# EAGLE design ne555_ht (EAGLE 7.6.0)
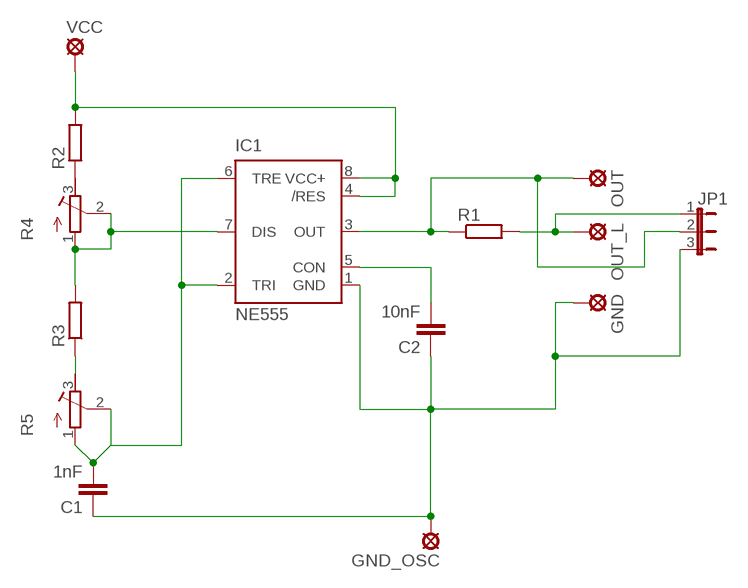
[diagram p0: schematic, sheet 1]

## Parts
C1  1nF  C-EU050-024X044  [C050-024X044]
C2  10nF  C-EU050-024X044  [C050-024X044]
GND  LSP13  [LSP13]
GND_OSC  LSP13  [LSP13]
IC1  NE555  [DIL-08]
JP1  JP2E  [JP2]
OUT  LSP13  [LSP13]
OUT_L  LSP13  [LSP13]
R1  R-EU_0207/10  [0207/10]
R2  R-EU_0207/12  [0207/12]
R3  R-EU_0207/12  [0207/12]
R4  R-TRIMM3339P  [RTRIM3339P]
R5  R-TRIMM3339P  [RTRIM3339P]
VCC  LSP13  [LSP13]

## Nets
N$1: R2.1 R4.3(E)
N$2: IC1.4(/RES) IC1.8(VCC+) R2.2 VCC.MP
N$3: C2.2 IC1.5(CON)
N$5: C1.1 C2.1 GND.MP GND_OSC.MP IC1.1(GND) JP1.3
N$8: IC1.3(OUT) JP1.2 OUT.MP R1.1
N$9: JP1.1 OUT_L.MP R1.2
N$11: IC1.7(DIS) R3.2 R4.1(A) R4.2(S)
N$12: R3.1 R5.3(E)
N$13: C1.2 IC1.2(TRI) IC1.6(TRE) R5.1(A) R5.2(S)

## Library data of the parts
C1 C2 = rcl:C-EU: CAPACITOR, European symbol
GND GND_OSC OUT OUT_L VCC = solpad:LSP13: SOLDER PAD drill 1.3 mm, distributor Buerklin, 12H562
IC1 = st-microelectronics:NE555: General purpose bipolar Timer; MF: Arrow Electronics; MPN: NE555N; OC_FARNELL: 1467742; OC_NEWARK: 89K1486
JP1 = jumper:JP2E: JUMPER
R1 = resistor:R-EU_: RESISTOR, European symbol
R2 R3 = rcl:R-EU_: RESISTOR, European symbol
R4 R5 = rcl:R-TRIMM: Trimm resistor

## Board
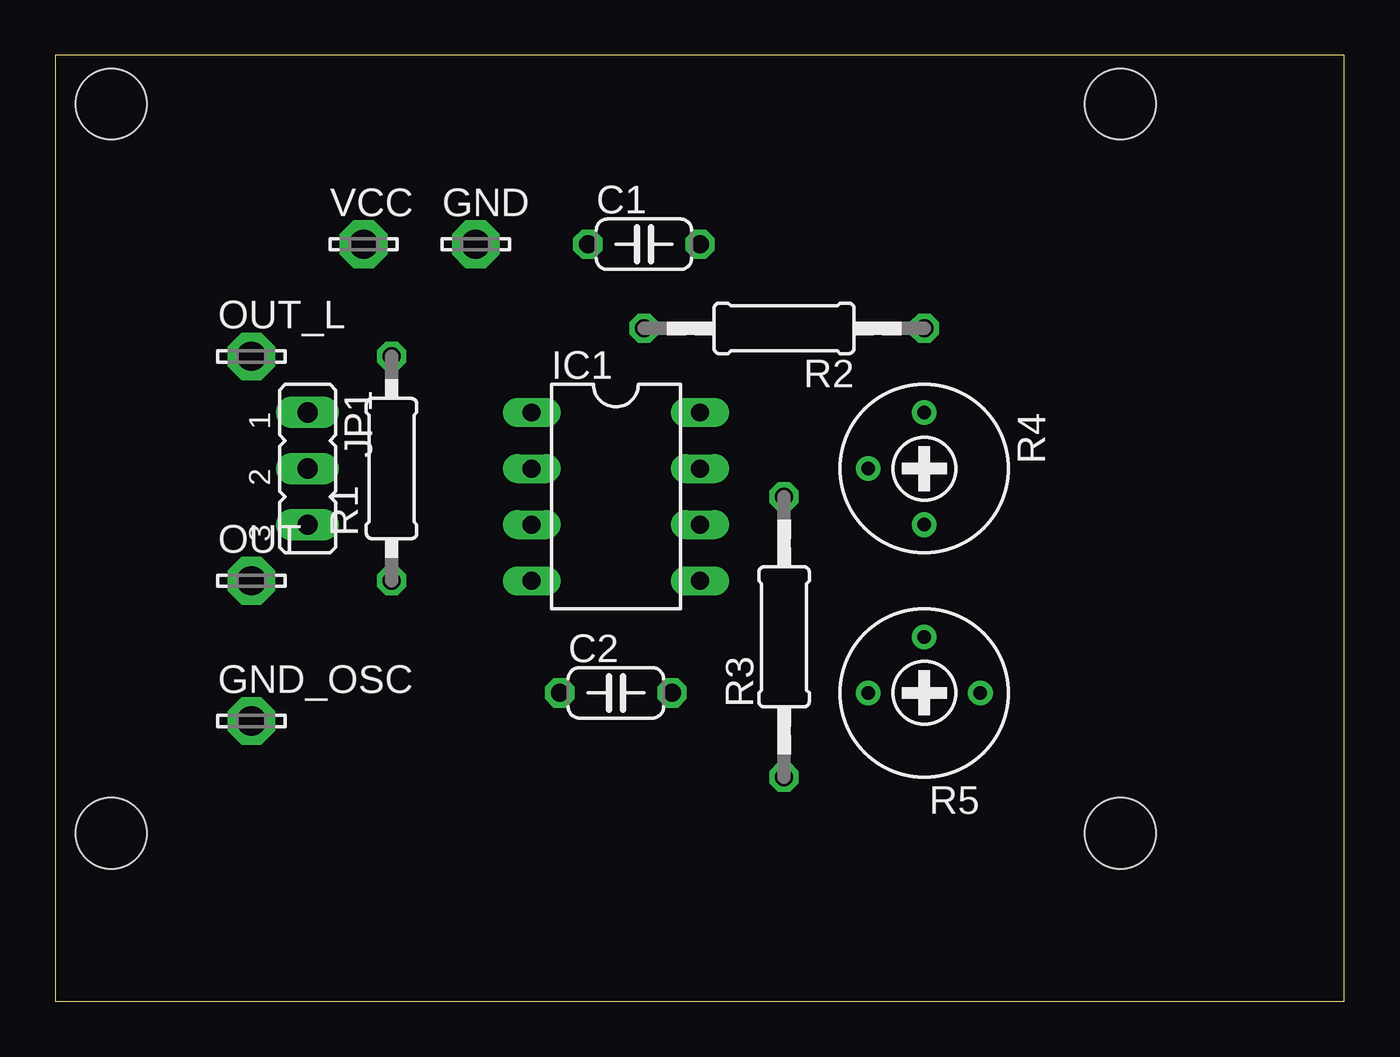
[diagram p1: board, top side]
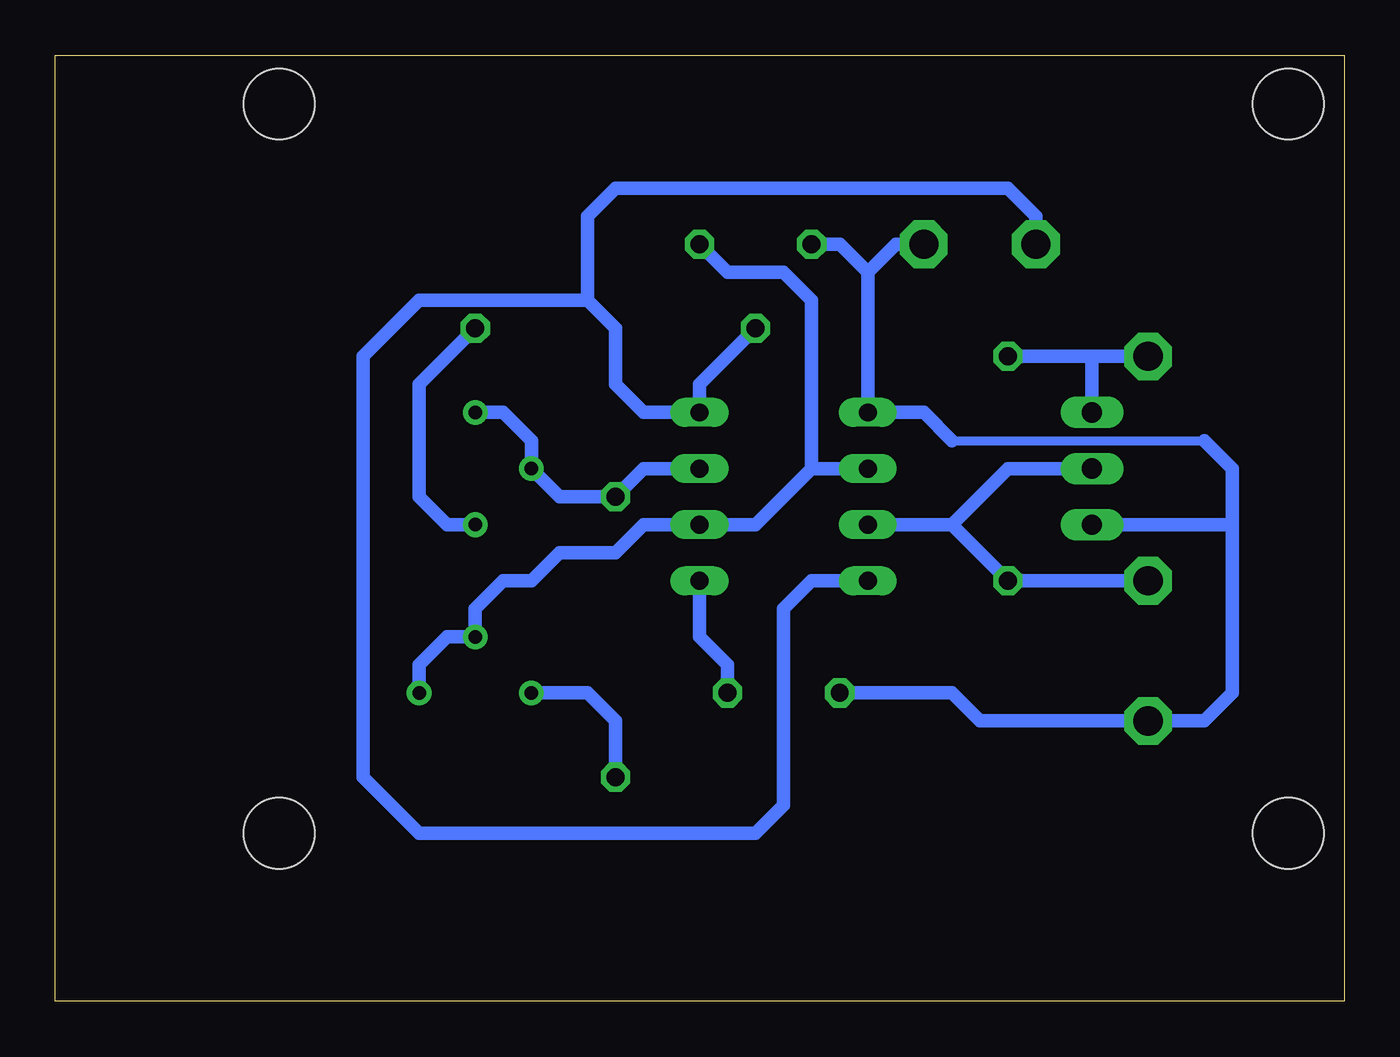
[diagram p2: board, bottom side, seen from below]

Size 58.4 x 42.85 mm. Coordinates in mm from the lower left corner, seen from the top.
Outline: 0,0 58.4,0 58.4,42.85 0,42.85 0,0
Copper layers (1*16): Top 0.035mm / dielectric 1.5mm / Bottom 0.035mm
Design rules "default": minimum track width 10mil, minimum drill 24mil, track to track 8mil, track to pad 8mil, pad to pad 8mil, via to via 8mil, smd to smd 8mil, copper to edge 40mil, drill to drill 8mil, minimum pad ring 10mil, minimum via ring 8mil, stop-mask expansion 4mil, vias tented up to drill 0mil, thermal gap 10mil
Holes 3.2 mm at 2.54,40.64 48.26,40.64 48.26,7.62 2.54,7.62

### Footprints (pad centres in the part's own frame; a part is rotated, then mirrored left to right if it is on the bottom)
C050-024X044 = drill 0.813 octagon: 1 -2.54,0; 2 2.54,0
LSP13 = drill 1.321 pad 2.159 octagon: MP 0,0
DIL-08 = drill 0.813 long: 1 -3.81,-3.81; 2 -1.27,-3.81; 3 1.27,-3.81; 4 3.81,-3.81; 5 3.81,3.81; 6 1.27,3.81; 7 -1.27,3.81; 8 -3.81,3.81
JP2 = drill 0.914 long: 1 -2.54,0; 2 0,0; 3 2.54,0
0207/10 = drill 0.813 octagon: 1 -5.08,0; 2 5.08,0
0207/12 = drill 0.813 octagon: 1 -6.35,0; 2 6.35,0
RTRIM3339P = drill 0.61: 1 -2.54,0; 2 0,-2.54; 3 2.54,0

### Placement (x,y rotation side)
C1  26.67,34.29 0 top
C2  25.4,13.97 0 top
GND  19.05,34.29 0 top
GND_OSC  8.89,12.7 0 top
IC1  25.4,22.86 270 top
JP1  11.43,24.13 270 top
OUT  8.89,19.05 0 top
OUT_L  8.89,29.21 0 top
R1  15.24,24.13 90 top
R2  33.02,30.48 180 top
R3  33.02,16.51 90 top
R4  39.37,24.13 270 top
R5  39.37,13.97 180 top
VCC  13.97,34.29 0 top

### Tracks (layer width: path | path; a pad name or v marks a point on that pad's centre or on a via)
N$1
  Bottom 0.61: R2.1 41.91,27.94 41.91,22.86 40.64,21.59 R4.3
N$2
  Bottom 0.61: R2.2 29.21,27.94 IC1.8 31.75,26.67 33.02,27.94 33.02,30.48 34.29,31.75 | 34.29,31.75 41.91,31.75 44.45,29.21 44.45,10.16 41.91,7.62 26.67,7.62 25.4,8.89 25.4,17.78 24.13,19.05 IC1.4 | VCC.MP 13.97,35.56 15.24,36.83 33.02,36.83 34.29,35.56 34.29,31.75
N$3
  Bottom 0.61: IC1.5 29.21,16.51 27.94,15.24 C2.2
N$5
  Bottom 0.406: 17.78,25.4 6.35,25.4
  Bottom 0.61: 21.59,33.02 IC1.1 19.05,26.67 17.78,25.4 | 21.59,33.02 22.86,34.29 C1.1 | GND.MP 20.32,34.29 21.59,33.02 | C2.1 17.78,13.97 16.51,12.7 GND_OSC.MP 6.35,12.7 5.08,13.97 5.08,21.59 | 6.35,25.4 5.08,24.13 5.08,21.59 | JP1.3 5.08,21.59
N$8
  Bottom 0.61: OUT.MP R1.1 17.78,21.59 | 17.78,21.59 IC1.3 | JP1.2 15.24,24.13 17.78,21.59
N$9
  Bottom 0.61: OUT_L.MP 11.43,29.21 | 11.43,29.21 R1.2 | JP1.1 11.43,29.21
N$11
  Bottom 0.61: R4.1 38.1,26.67 36.83,25.4 R4.2 35.56,22.86 R3.2 31.75,24.13 IC1.7
N$12
  Bottom 0.61: R3.1 33.02,12.7 34.29,13.97 R5.3
N$13
  Bottom 0.61: R5.1 41.91,15.24 40.64,16.51 R5.2 39.37,17.78 38.1,19.05 36.83,19.05 35.56,20.32 33.02,20.32 31.75,21.59 IC1.6 26.67,21.59 24.13,24.13 | IC1.2 24.13,24.13 | C1.2 27.94,33.02 25.4,33.02 24.13,31.75 24.13,24.13